# Altium schematic sheet controle_motor_chave.SchDoc
size A4; SheetNumber: 4; SheetTotal: 4
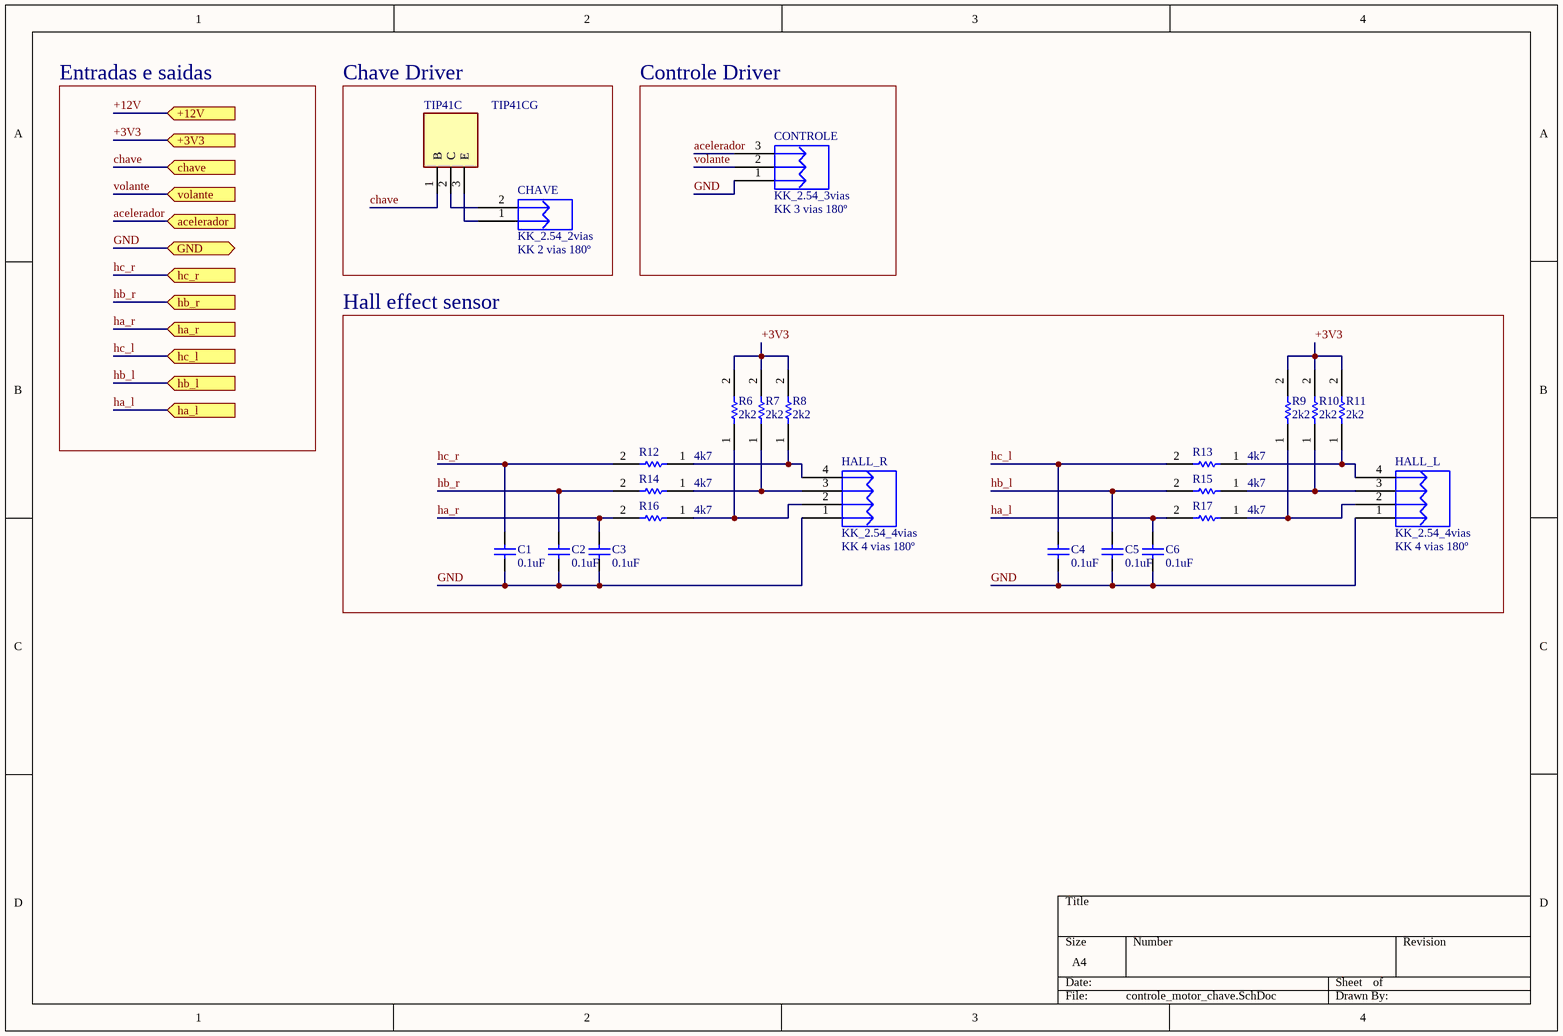
[diagram p0: controle_motor_chave.SchDoc]

## Parts
C1  0.1uF  [CAP CER DISK 0.1uF]
C2  0.1uF  [CAP CER DISK 0.1uF]
C3  0.1uF  [CAP CER DISK 0.1uF]
C4  0.1uF  [CAP CER DISK 0.1uF]
C5  0.1uF  [CAP CER DISK 0.1uF]
C6  0.1uF  [CAP CER DISK 0.1uF]
CHAVE  KK_2.54_2vias  Valor: KK 2 vias 180º  [KK_2VIAS_180º]
CONTROLE  KK_2.54_3vias  Valor: KK 3 vias 180º  [KK_3vias_180º]
HALL_L  KK_2.54_4vias  Valor: KK 4 vias 180º  [KK_4vias_180°]
HALL_R  KK_2.54_4vias  Valor: KK 4 vias 180º  [KK_4vias_180°]
R6  2k2  [RESC3216X60N]
R7  2k2  [RESC3216X60N]
R8  2k2  [RESC3216X60N]
R9  2k2  [RESC3216X60N]
R10  2k2  [RESC3216X60N]
R11  2k2  [RESC3216X60N]
R12  4k7  [RESC3216X60N]
R13  4k7  [RESC3216X60N]
R14  4k7  [RESC3216X60N]
R15  4k7  [RESC3216X60N]
R16  4k7  [RESC3216X60N]
R17  4k7  [RESC3216X60N]
TIP41C  TIP41CG  [TO254P483X1010X2035-3P]

## Blocks framed on the sheet
Chave Driver: CHAVE TIP41C
Controle Driver: CONTROLE
Hall effect sensor: C1-C6 HALL_L HALL_R R6-R17

## Ports
+3V3 (in), +12V (in), acelerador (in), chave (in), GND (bidir), ha_l (in), ha_r (in), hb_l (in), hb_r (in), hc_l (in), hc_r (in), volante (in)

## Nets
+3V3: R6.2 R7.2 R8.2 R9.2 R10.2 R11.2 ; port +3V3
+12V: port +12V
acelerador: CONTROLE.3 ; port acelerador
chave: TIP41C.1(B) ; port chave
GND: C1.1 C2.1 C3.1 C4.1 C5.1 C6.1 CONTROLE.1 HALL_L.1 HALL_R.1 ; port GND
ha_l: C6.2 R17.2 ; port ha_l
ha_r: C3.2 R16.2 ; port ha_r
hb_l: C5.2 R15.2 ; port hb_l
hb_r: C2.2 R14.2 ; port hb_r
hc_l: C4.2 R13.2 ; port hc_l
hc_r: C1.2 R12.2 ; port hc_r
volante: CONTROLE.2 ; port volante
NetCHAVE_1: CHAVE.1 TIP41C.3(E)
NetCHAVE_2: CHAVE.2 TIP41C.2(C)
NetHALL_L_2: HALL_L.2 R9.1 R17.1
NetHALL_L_3: HALL_L.3 R10.1 R15.1
NetHALL_L_4: HALL_L.4 R11.1 R13.1
NetHALL_R_2: HALL_R.2 R6.1 R16.1
NetHALL_R_3: HALL_R.3 R7.1 R14.1
NetHALL_R_4: HALL_R.4 R8.1 R12.1

## Notes on the sheet
- Entradas e saidas

## Library data of the parts
C1-C6 = CAP CER DISK 0.1uF: Manufacturer Part Number: IMP14925; Product Range: MCFY Series; Capacitance Tolerance: +80%, -20%; Dielectric Characteristic: Y5; Voltage Rating: 50; Capacitor Terminals: Radial Leaded; SVHC: No SVHC (15-Jun-2015); Supplier 1: Mult Comercial; Manufacturer: -; RoHS: YES; Stock 1: 115809; Pricing 1: 1=0.10 (BRL); Capacitance: 0.1uF; Packaging: Each; Lead Spacing: 5; Operating Temperature Min: -25; Operating Temperature Max: 85; Capacitance Tolerance ±: +80%, -20%; Operating Temperature Range: -25°C to +85°C<!--FANDB--><div class="features-and-benefits-container"><div class="features-and-benefits-description"><span class="features-benefits-value">The MCFY series from Multicomp are radial leaded ceramic disc capacitors. The capacitance values ranges from 6800pF to 0.22?F.</span></div><div class="features-and-benefits-list"><ul class="features-and-benefits-list-list"><li class="features-and-benefits-list-item">Large capacitance in small size</li><li class="features-and-benefits-list-item">Rated voltage of 50V</li><li class="features-and-benefits-list-item">80%/-20% tolerance</li><li class="features-and-benefits-list-item">Operating temperature range -25°C to +85; ComponentLink1URL: http://loja.multcomercial.com.br/capacitor-ceramico-disco-100kpf-50v-104-100k-100nf-0-1uf-cod-1351.html; ComponentLink1Description: http://loja.multcomercial.com.br/capacitor-ceramico-disco-100kpf-50v-104-100k-100nf-0-1uf-cod-1351.html; Supplier Part Number 1: Capacitor Cerâmico Disco 100Kpf/50V (104/100K/100nF/0.1uF) cód. 1351
CHAVE = KK_2.54_2vias: Conector KK 2.54mm 2 vias; Descrição: Conector KK 3 vias com passo 2.54mm; Encapsulamento: PTH - 180º; Modelo: 2 vias - 180º; Marca: *; Observação: *
CONTROLE = KK_2.54_3vias: Conector KK 2.54mm 3 vias; Descrição: Conector KK 3 vias com passo 2.54mm; Encapsulamento: PTH - 180º; Modelo: 3 vias - 180º; Marca: *; Observação: *
HALL_L HALL_R = KK_2.54_4vias: Conector KK 2.54mm 4 vias; Descrição: Conector KK 3 vias com passo 2.54mm; Encapsulamento: PTH - 180º; Modelo: 3 vias - 180º; Marca: *; Observação: *
R6-R11 = Resistor 1206: Resistor; Manufacturer_Name: Vishay; Manufacturer_Part_Number: CRCW12064K70FKEA; Datasheet Link: http://docs-emea.rs-online.com/webdocs/13ec/0900766b813ecc08.pdf; Height: 0.6mm; Mouser Part Number: 71-CRCW1206-4.7K-E3; Mouser Price/Stock: https://www.mouser.co.uk/ProductDetail/Vishay-Dale/CRCW12064K70FKEA?qs=1vm4qhDHCvlKJmatsKzyFQ%3D%3D; Arrow Part Number: CRCW12064K70FKEA; Arrow Price/Stock: https://www.arrow.com/en/products/crcw12064k70fkea/vishay
R12-R17 = RES 1206: RES 1206 5%; Manufacturer_Name: Vishay; Manufacturer_Part_Number: CRCW12064K70FKEA; Datasheet Link: http://docs-emea.rs-online.com/webdocs/13ec/0900766b813ecc08.pdf; Height: 0.6mm; Mouser Part Number: 71-CRCW1206-4.7K-E3; Mouser Price/Stock: https://www.mouser.co.uk/ProductDetail/Vishay-Dale/CRCW12064K70FKEA?qs=1vm4qhDHCvlKJmatsKzyFQ%3D%3D; Arrow Part Number: CRCW12064K70FKEA; Arrow Price/Stock: https://www.arrow.com/en/products/crcw12064k70fkea/vishay
TIP41C = TIP41CG: Transistor; Manufacturer_Name: ON Semiconductor; Datasheet Link: http://www.onsemi.com/pub/Collateral/TIP41A-D.PDF; Height: 4.83mm; Manufacturer_Part_Number: TIP41CG; Mouser Part Number: 863-TIP41CG; Mouser Price/Stock: https://www.mouser.co.uk/ProductDetail/onsemi/TIP41CG?qs=xZq1yRCsb1dnnb4X32QAFQ%3D%3D; Arrow Part Number: TIP41CG; Arrow Price/Stock: https://www.arrow.com/en/products/tip41cg/on-semiconductor